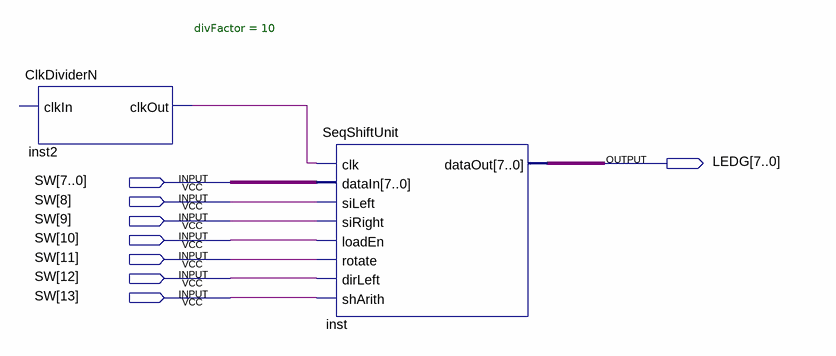
[diagram p0: schematic sheet]
// Quartus schematic SeqShiftUnit_Demo.bdf as structural Verilog: 2 symbols, 8 pins
module SeqShiftUnit_Demo (
  input  [13:0] SW,
  output [7:0] LEDG
);

  wire inst2_clkout;

  ClkDividerN #(.divFactor(10)) inst2 (.clkOut(inst2_clkout));  // open: clkIn
  SeqShiftUnit inst (
    .clk(inst2_clkout), .dataIn(SW[7:0]), .siLeft(SW[8]), .siRight(SW[9]), .loadEn(SW[10]), .rotate(SW[11]),
    .dirLeft(SW[12]), .shArith(SW[13]), .dataOut(LEDG));
endmodule
